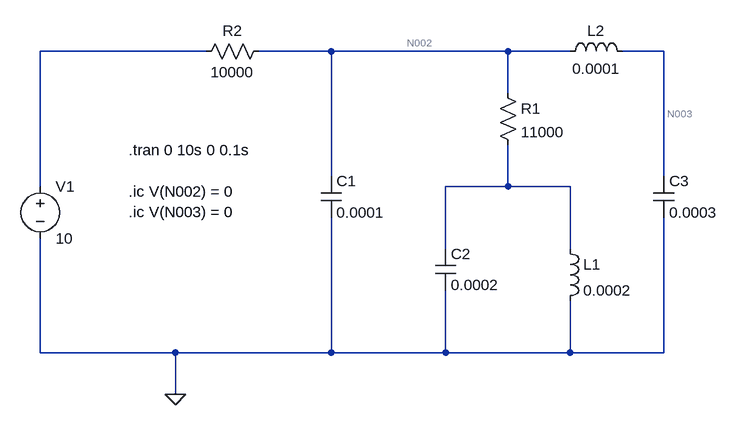
[diagram p0: schematic Q4.asc]
Q4.asc, the LTspice schematic file:
Version 4
SHEET 1 1100 680
WIRE 304 112 48 112
WIRE 496 112 384 112
WIRE 768 112 496 112
WIRE 864 112 768 112
WIRE 1008 112 944 112
WIRE 768 176 768 112
WIRE 496 304 496 112
WIRE 1008 304 1008 112
WIRE 48 320 48 112
WIRE 768 320 768 256
WIRE 768 320 672 320
WIRE 864 320 768 320
WIRE 672 416 672 320
WIRE 864 416 864 320
WIRE 48 576 48 400
WIRE 256 576 48 576
WIRE 496 576 496 368
WIRE 496 576 256 576
WIRE 672 576 672 480
WIRE 672 576 496 576
WIRE 864 576 864 496
WIRE 864 576 672 576
WIRE 1008 576 1008 368
WIRE 1008 576 864 576
WIRE 256 640 256 576
FLAG 256 640 0
SYMBOL cap 480 304 R0
SYMATTR InstName C1
SYMATTR Value 0.0001
SYMBOL cap 656 416 R0
SYMATTR InstName C2
SYMATTR Value 0.0002
SYMBOL cap 992 304 R0
SYMATTR InstName C3
SYMATTR Value 0.0003
SYMBOL ind 848 400 R0
SYMATTR InstName L1
SYMATTR Value 0.0002
SYMBOL ind 848 128 R270
WINDOW 0 32 56 VTop 2
WINDOW 3 5 56 VBottom 2
SYMATTR InstName L2
SYMATTR Value 0.0001
SYMBOL res 752 160 R0
SYMATTR InstName R1
SYMATTR Value 11000
SYMBOL res 400 96 R90
WINDOW 0 0 56 VBottom 2
WINDOW 3 32 56 VTop 2
SYMATTR InstName R2
SYMATTR Value 10000
SYMBOL voltage 48 304 R0
SYMATTR InstName V1
SYMATTR Value 10
TEXT 184 264 Left 2 !.tran 0 10s 0 0.1s
TEXT 184 328 Left 2 !.ic V(N002) = 0\n.ic V(N003) = 0

The netlist it stands for:
* Q4.asc
C1 N002 0 0.0001
C2 N004 0 0.0002
C3 N003 0 0.0003
L1 N004 0 0.0002
L2 N002 N003 0.0001
R1 N002 N004 11000
R2 N002 N001 10000
V1 N001 0 10
.tran 0 10s 0 0.1s
.ic V(N002) = 0
.ic V(N003) = 0
.backanno
.end